# EAGLE schematic schematicsv2 (EAGLE 9.3.2)
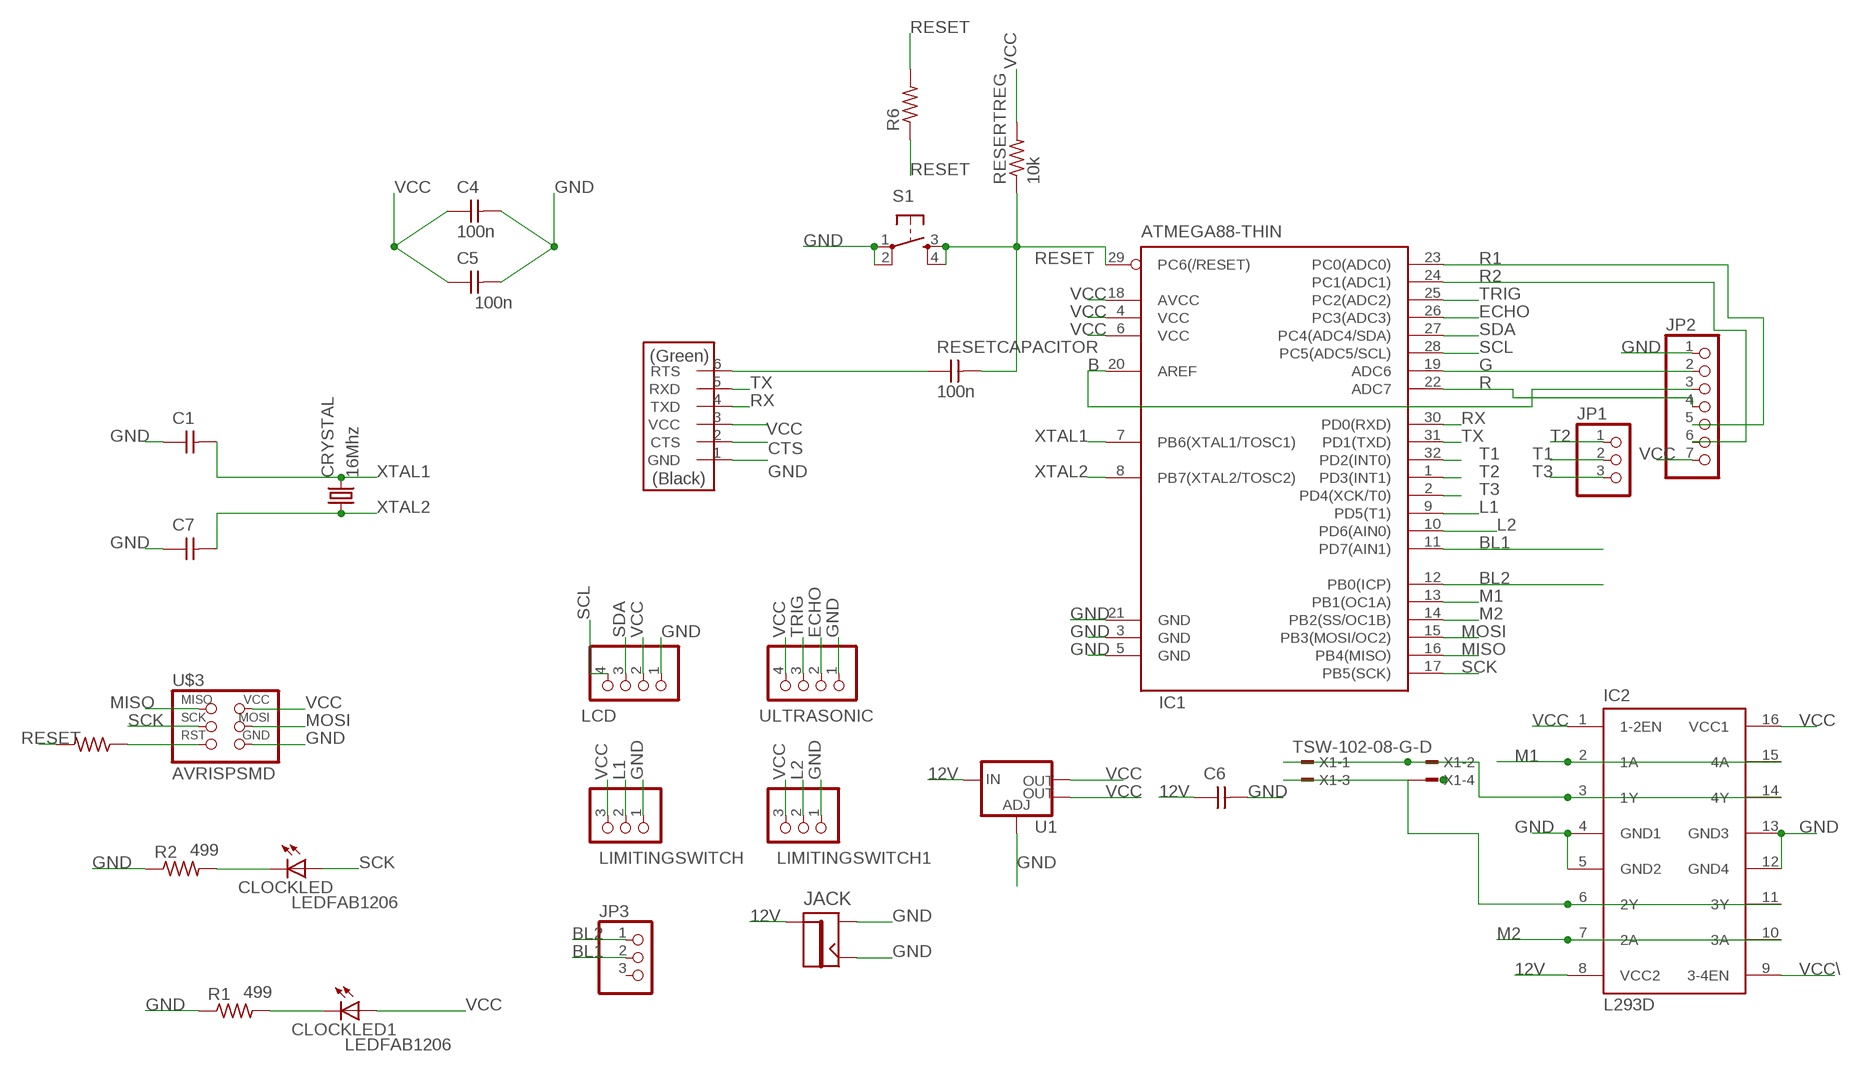
[diagram p0: schematic, sheet 1]

## Parts
C1  CAP-UNPOLARIZEDFAB  [C1206FAB]
C4  100n  CAP-UNPOLARIZEDFAB  [C1206FAB]
C5  100n  CAP-UNPOLARIZEDFAB  [C1206FAB]
C6  CAP-UNPOLARIZEDFAB  [C1206FAB]
C7  CAP-UNPOLARIZEDFAB  [C1206FAB]
CLOCKLED  LEDFAB1206  [LED1206FAB]
CLOCKLED1  LEDFAB1206  [LED1206FAB]
CRYSTAL  16Mhz  CSM-7X-DU  [CSM-7X-DU]
IC1  ATMEGA88-THIN  [TQFP32-08THIN]
IC2  L293D  [DIL16]
JACK  JACK2.1MM  [JACK_2.1MM]
JP1  PINHD-1X31X03_SMT  [1X03_SMT]
JP2  PINHD-1X71X07_SMT  [1X07_SMT]
JP3  PINHD-1X31X03_SMT  [1X03_SMT]
LCD  PINHD-1X41X04_SMT  [1X04_SMT]
LIMITINGSWITCH  PINHD-1X31X03_SMT  [1X03_SMT]
LIMITINGSWITCH1  PINHD-1X31X03_SMT  [1X03_SMT]
R1  499  RES-US1206FAB  [R1206FAB]
R2  499  RES-US1206FAB  [R1206FAB]
R4  1000  RES-US1206FAB  [R1206FAB]
R6  1000  RES-US1206FAB  [R1206FAB]
RESERTREG  10k  RES-US1206FAB  [R1206FAB]
RESETCAPACITOR  100n  CAP-UNPOLARIZEDFAB  [C1206FAB]
S1  6MM_SWITCH6MM_SWITCH  [6MM_SWITCH]
U1  V_REG_LM1117SOT223  [SOT223]
U$2  FTDI-SMD-HEADER  [1X06SMD]
U$3  AVRISPSMD  [2X03SMD]
ULTRASONIC  PINHD-1X41X04_SMT  [1X04_SMT]
X1  TSW-102-08-G-D  [TSW-102-XX-G-D]

## Nets
12V: C6.1 IC2.8(VCC2) JACK.PIN U1.3(IN)
B: IC1.20(AREF) JP2.3
BL1: IC1.11(PD7(AIN1)) JP3.2
BL2: IC1.12(PB0(ICP)) JP3.1
CTS: U$2.2(CTS)
ECHO: IC1.26(PC3(ADC3)) ULTRASONIC.2
G: IC1.19(ADC6) JP2.2
GND: C1.1 C4.2 C5.2 C6.2 C7.1 IC1.3(GND) IC1.5(GND) IC1.21(GND) IC2.4(GND1) IC2.5(GND2) IC2.12(GND4) IC2.13(GND3) JACK.CONTACT JACK.SHUNT JP2.1 LCD.1 LIMITINGSWITCH1.1 LIMITINGSWITCH.1 R1.1 R2.1 S1.1(P) S1.2(P1) U1.1(ADJ) U$2.1(GND) U$3.6(GND) ULTRASONIC.1
L1: IC1.9(PD5(T1)) LIMITINGSWITCH.2
L2: IC1.10(PD6(AIN0)) LIMITINGSWITCH1.2
M1: IC1.13(PB1(OC1A)) IC2.2(1A) IC2.15(4A)
M2: IC1.14(PB2(SS/OC1B)) IC2.7(2A) IC2.10(3A)
MISO: IC1.16(PB4(MISO)) U$3.1(MISO)
MOSI: IC1.15(PB3(MOSI/OC2)) U$3.4(MOSI)
N$3: CLOCKLED.2(C) R2.2
N$5: CLOCKLED1.2(C) R1.2
N$6: R4.1 U$3.5(RST)
N$7: RESETCAPACITOR.1 U$2.6(RTS)
N$32: IC2.3(1Y) IC2.14(4Y) X1.1 X1.2
N$34: IC2.6(2Y) IC2.11(3Y) X1.3 X1.4
R: IC1.22(ADC7) JP2.4
R1: IC1.23(PC0(ADC0)) JP2.5
R2: IC1.24(PC1(ADC1)) JP2.6
RESET: IC1.29(PC6(/RESET)) R4.2 R6.1 R6.2 RESERTREG.1 RESETCAPACITOR.2 S1.3(S) S1.4(S1)
RX: IC1.30(PD0(RXD)) U$2.4(TXD)
SCK: CLOCKLED.1(A) IC1.17(PB5(SCK)) U$3.3(SCK)
SCL: IC1.28(PC5(ADC5/SCL)) LCD.4
SDA: IC1.27(PC4(ADC4/SDA)) LCD.3
T1: IC1.32(PD2(INT0)) JP1.2
T2: IC1.1(PD3(INT1)) JP1.1
T3: IC1.2(PD4(XCK/T0)) JP1.3
TRIG: IC1.25(PC2(ADC2)) ULTRASONIC.3
TX: IC1.31(PD1(TXD)) U$2.5(RXD)
VCC: C4.1 C5.1 CLOCKLED1.1(A) IC1.4(VCC) IC1.6(VCC) IC1.18(AVCC) IC2.1(1-2EN) IC2.16(VCC1) JP2.7 LCD.2 LIMITINGSWITCH1.3 LIMITINGSWITCH.3 RESERTREG.2 U1.2(OUT) U1.4(OUT) U$2.3(VCC) U$3.2(VCC) ULTRASONIC.4
VCC\: IC2.9(3-4EN)
XTAL1: C1.2 CRYSTAL.2 IC1.7(PB6(XTAL1/TOSC1))
XTAL2: C7.2 CRYSTAL.1 IC1.8(PB7(XTAL2/TOSC2))
Unconnected: JP3.3

## Library data of the parts
C1 C4-C7 RESETCAPACITOR = fab:CAP-UNPOLARIZED
CLOCKLED CLOCKLED1 = fab:LED: LED
CRYSTAL = 01_FAB_Hello:CSM-7X-DU: SMD CRYSTAL Source: www.ecsxtal.com .. Crystal 3.6864MHz CSM_7X_DU.PDF; OC_FARNELL: unknown; OC_NEWARK: unknown
IC1 = fab:ATMEGA88-THIN
IC2 = st-microelectronics:L293D: PUSH-PULL 4 CHANNEL DRIVER; MPN: L293D; OC_FARNELL: 9589619; OC_NEWARK: 56P8249
JACK = fab (1):JACK
JP1 JP3 LIMITINGSWITCH LIMITINGSWITCH1 = smd_con:PINHD-1X3: PIN HEADER
JP2 = smd_con:PINHD-1X7: PIN HEADER
LCD ULTRASONIC = smd_con:PINHD-1X4: PIN HEADER
R1 R2 R4 R6 RESERTREG = fab:RES-US: Resistor (US Symbol) Variants with postfix FAB are widened to allow the routing of internal traces
S1 = fab:6MM_SWITCH: OMRON SWITCH
U1 = fab:V_REG_LM1117: Voltage Regulator LM1117 Standard adjustable voltage regulator but in SMD form. Spark Fun Electronics SKU : COM-00595; PROD_ID: VREG-08170
U$2 = fab:FTDI-SMD-HEADER
U$3 = fab:AVRISP
X1 = con-samtec:TSW-102-*-G: THROUGH-HOLE .025" SQ POST HEADER Source: Samtec TSW.pdf; MF: Samtec Inc.; MPN: TSW-102-07-G-D